# Altium project UltraZohm_ADC.PrjPCB (part 1 of 2)
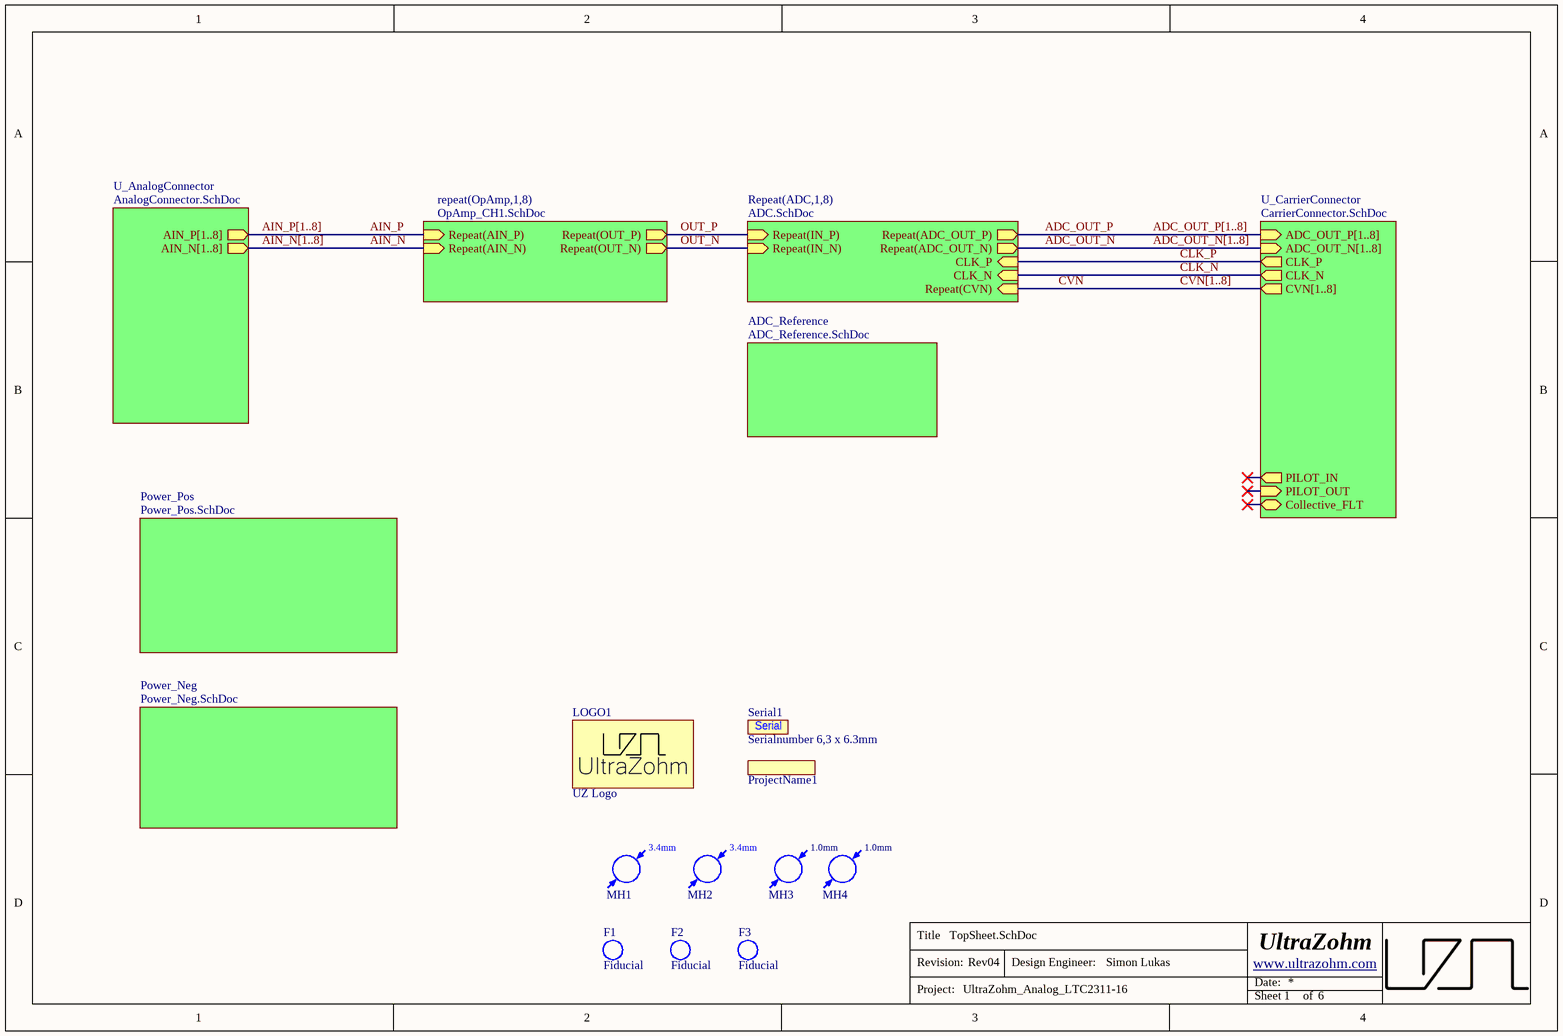
[diagram p0: TopSheet.SchDoc]
ProjectRevision: Rev04; ProjectName: UltraZohm_Analog_LTC2311-16; ProjectAuthor: Simon Lukas; Date: 09/20; AuthorParam: Simon Lukas; Author: S.Lukas
7 sheets, 508 parts. Net scope: hierarchical (ports join the sheet entries above them; power ports are global).
Board file: UltraZohm_ADC.PcbDoc
Sheets:
  TopSheet.SchDoc
    U_CarrierConnector = CarrierConnector.SchDoc
    U_AnalogConnector = AnalogConnector.SchDoc
    ADC1 = ADC.SchDoc
    ADC2 = ADC.SchDoc
    ADC3 = ADC.SchDoc
    ADC4 = ADC.SchDoc
    ADC5 = ADC.SchDoc
    ADC6 = ADC.SchDoc
    ADC7 = ADC.SchDoc
    ADC8 = ADC.SchDoc
    OpAmp1 = OpAmp_CH1.SchDoc
    OpAmp2 = OpAmp_CH1.SchDoc
    OpAmp3 = OpAmp_CH1.SchDoc
    OpAmp4 = OpAmp_CH1.SchDoc
    OpAmp5 = OpAmp_CH1.SchDoc
    OpAmp6 = OpAmp_CH1.SchDoc
    OpAmp7 = OpAmp_CH1.SchDoc
    OpAmp8 = OpAmp_CH1.SchDoc
    Power_Neg = Power_Neg.SchDoc
  Power.SchDoc

## Sheet TopSheet.SchDoc
size A4; Author: Simon Lukas; CompanyName: Technische Hochschule Nürnberg Georg Simon Ohm; Organization: UltraZohm; Address1: Kesslerplatz 12; Address2: 90489 Nürnberg; Address3: GERMANY; DocumentNumber: 1; SheetNumber: 1; SheetTotal: 6; Website: www.ultrazohm.com

### Parts
F1  Fiducial  [Fiducial_1.7mm]  (no BOM)
F2  Fiducial  [Fiducial_1.7mm]  (no BOM)
F3  Fiducial  [Fiducial_1.7mm]  (no BOM)
LOGO1  UZ Logo  [UZ_Logo_tiny]  (no BOM)
MH1  mounting hole 3,4mm  [MH_3.4]  (value not drawn)  (no BOM)
MH2  mounting hole 3,4mm  [MH_3.4]  (value not drawn)  (no BOM)
MH3  alignment hole 1mm  [MH_1]  (value not drawn)
MH4  alignment hole 1mm  [MH_1]  (value not drawn)
ProjectName1  Project Name, Rev  [ID_ProjectRev]  (value not drawn)  (no BOM)
Serial1  Serialnumber 6,3 x 6.3mm  [Serial_6.3x6.3mm]  (no BOM)

### Sub-sheets
ADC_Reference = ADC_Reference.SchDoc (file not in this document): no entries
Power_Neg = Power_Neg.SchDoc: no entries
Power_Pos = Power_Pos.SchDoc (file not in this document): no entries
Repeat(ADC,1,8) = ADC.SchDoc: Repeat(CVN) (in), Repeat(ADC_OUT_N) (out), Repeat(ADC_OUT_P) (out), Repeat(IN_N) (in), CLK_P (in), CLK_N (in), Repeat(IN_P) (in)
repeat(OpAmp,1,8) = OpAmp_CH1.SchDoc: Repeat(AIN_P) (in), Repeat(AIN_N) (in), Repeat(OUT_P) (out), Repeat(OUT_N) (out)
U_AnalogConnector = AnalogConnector.SchDoc: AIN_P[1..8] (out), AIN_N[1..8] (out)
U_CarrierConnector = CarrierConnector.SchDoc: PILOT_OUT (in), PILOT_IN (out), Collective_FLT (bidir), CLK_P (out), CLK_N (out), ADC_OUT_P[1..8] (in), ADC_OUT_N[1..8] (in), CVN[1..8] (out)

### Nets
ADC_OUT_N: sheet Repeat(ADC,1,8)/Repeat(ADC_OUT_N)
ADC_OUT_P: sheet Repeat(ADC,1,8)/Repeat(ADC_OUT_P)
AIN_N: sheet repeat(OpAmp,1,8)/Repeat(AIN_N)
AIN_P: sheet repeat(OpAmp,1,8)/Repeat(AIN_P)
CLK_N: sheet U_CarrierConnector/CLK_N, sheet Repeat(ADC,1,8)/CLK_N
CLK_P: sheet U_CarrierConnector/CLK_P, sheet Repeat(ADC,1,8)/CLK_P
CVN: sheet Repeat(ADC,1,8)/Repeat(CVN)
OUT_N: sheet Repeat(ADC,1,8)/Repeat(IN_N), sheet repeat(OpAmp,1,8)/Repeat(OUT_N)
OUT_P: sheet Repeat(ADC,1,8)/Repeat(IN_P), sheet repeat(OpAmp,1,8)/Repeat(OUT_P)

### Buses and harness runs
bus ADC_OUT_N[1..8] = sheet U_CarrierConnector/ADC_OUT_N[1..8]
bus ADC_OUT_P[1..8] = sheet U_CarrierConnector/ADC_OUT_P[1..8]
bus AIN_N[1..8] = sheet U_AnalogConnector/AIN_N[1..8]
bus AIN_P[1..8] = sheet U_AnalogConnector/AIN_P[1..8]
bus CVN[1..8] = sheet U_CarrierConnector/CVN[1..8]

### Notes on the sheet
- Title
- Revision:
- Design Engineer:
- Date:
- Project:
- Sheet
- of
- (in symbol Mounting Hole) 3.4mm
- (in symbol Mounting Hole - 1mm) 1.0mm
- (in symbol SerialNumber) Serial

### Library data of the parts
F1-F3 = Fiducial: Fiducial for Assembler
LOGO1 = UZ Logo: UltraZohm Logo on PCB; Created: Jan2021_Liegmann; Value: UZ Logo
MH1 MH2 = Mounting Hole: Non plated through hole, 3.4mm
MH3 MH4 = Mounting Hole - 1mm: Non plated through hole, 1mm
ProjectName1 = ID_ProjectRev: Project Name and Revision Number; Created: 2018_11_23_AGeiger; Value: Project Name, Rev
Serial1 = SerialNumber: Created: 2018_09_18_AGeiger; Value: Serialnumber 6,3 x 6.3mm

## Sheet CarrierConnector.SchDoc
size A4; Author: Simon Lukas; CompanyName: Technische Hochschule Nürnberg Georg Simon Ohm; Organization: UltraZohm; Address1: Kesslerplatz 12; Address2: 90489 Nürnberg; Address3: GERMANY; DocumentNumber: 3; SheetNumber: 3; SheetTotal: 6; Website: www.ultrazohm.com
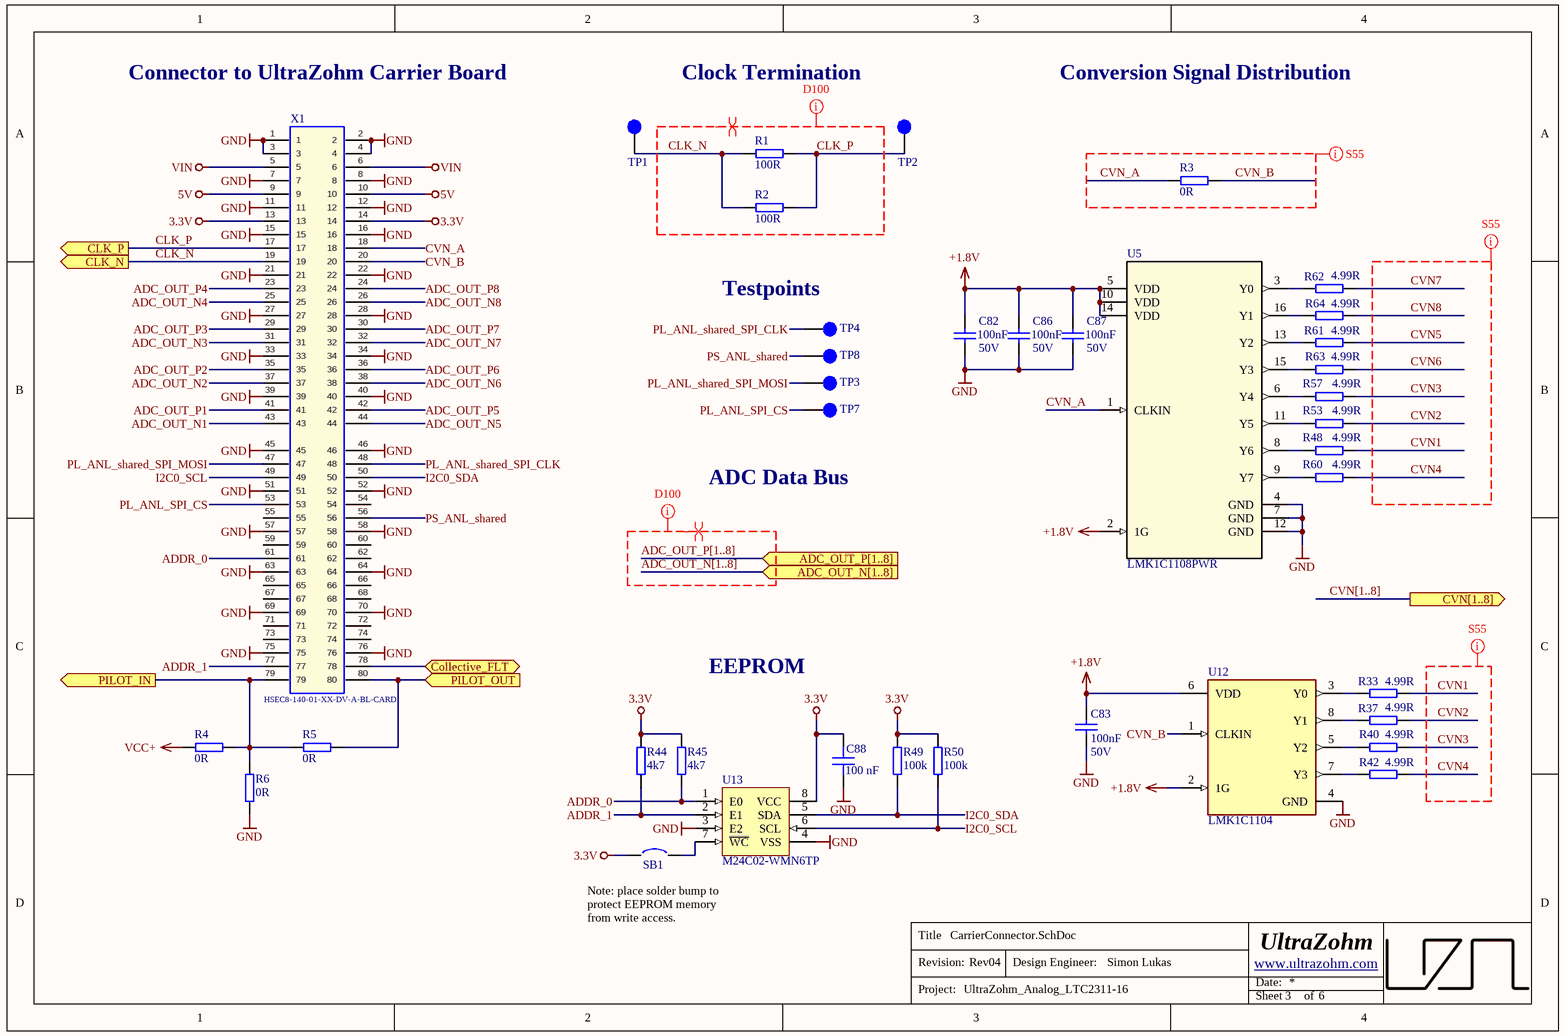
[diagram p1: CarrierConnector.SchDoc]

### Parts
C82  100nF  Voltage: 50V  [CAPC1608X07N]
C83  100nF  Voltage: 50V  [CAPC1608X07N]
C86  100nF  Voltage: 50V  [CAPC1608X07N]
C87  100nF  Voltage: 50V  [CAPC1608X07N]
C88  100 nF  [C_0603]
R1  100R  [RESC1608X06N]
R2  100R  [RESC1608X06N]
R3  0R  [RESC1608X06N]
R4  0R  [RESC1608X06N]
R5  0R  [RESC1608X06N]
R6  0R  [RESC1608X06N]
R33  4.99R  [RESC1608X06N]
R37  4.99R  [RESC1608X06N]
R40  4.99R  [RESC1608X06N]
R42  4.99R  [RESC1608X06N]
R44  4k7  [RES 0603_1608]
R45  4k7  [RES 0603_1608]
R48  4.99R  [RESC1608X06N]
R49  100k  [RES 0603_1608]
R50  100k  [RES 0603_1608]
R53  4.99R  [RESC1608X06N]
R57  4.99R  [RESC1608X06N]
R60  4.99R  [RESC1608X06N]
R61  4.99R  [RESC1608X06N]
R62  4.99R  [RESC1608X06N]
R63  4.99R  [RESC1608X06N]
R64  4.99R  [RESC1608X06N]
SB1  Solder Bump 0603  [SB_0603]  (value not drawn)  (no BOM)
TP1  ACLK_N  [TP_1mm]  (value not drawn)  (no BOM)
TP2  ACLK_P  [TP_1mm]  (value not drawn)  (no BOM)
TP3  PIN47  [TP_1mm]  (value not drawn)  (no BOM)
TP4  PIN48  [TP_1mm]  (value not drawn)  (no BOM)
TP7  PIN53  [TP_1mm]  (value not drawn)  (no BOM)
TP8  PIN56  [TP_1mm]  (value not drawn)  (no BOM)
U5  LMK1C1108PWR  [PW0016A_M]
U12  LMK1C1104  [FP-PW0008A-MFG]
U13  M24C02-WMN6TP  [D0008A_N]
X1  HSEC8-140-01-XX-DV-A-BL-CARD  [HSEC8-140-01-XX-DV-A-BL-CARD]  (no BOM)

### Ports
ADC_OUT_N[1..8] (in), ADC_OUT_P[1..8] (in), CLK_N (out), CLK_P (out), Collective_FLT (bidir), CVN[1..8] (out), PILOT_IN (out), PILOT_OUT (in)

### Nets
3.3V: C88.1 R44.2 R45.2 R49.2 R50.2 SB1.1 U13.8(VCC) X1.13 X1.14
5V: X1.9 X1.10
+1.8V: C82.1 C83.1 C86.1 C87.1 U5.2(1G) U5.5(VDD) U5.10(VDD) U5.14(VDD) U12.2(1G) U12.6(VDD)
GND: C82.2 C83.2 C86.2 C87.2 C88.2 R6.1 U5.4(GND) U5.7(GND) U5.12(GND) U12.4(GND) U13.3(E2) U13.4(VSS) X1.1 X1.2 X1.3 X1.4 X1.7 X1.8 X1.11 X1.12 X1.15 X1.16 X1.21 X1.22 X1.27 X1.28 X1.33 X1.34 X1.39 X1.40 X1.45 X1.46 X1.51 X1.52 X1.57 X1.58 X1.63 X1.64 X1.69 X1.70 X1.75 X1.76
VCC+: R4.1
VIN: X1.5 X1.6
ADC_OUT_N1: X1.43
ADC_OUT_N2: X1.37
ADC_OUT_N3: X1.31
ADC_OUT_N4: X1.25
ADC_OUT_N5: X1.44
ADC_OUT_N6: X1.38
ADC_OUT_N7: X1.32
ADC_OUT_N8: X1.26
ADC_OUT_P1: X1.41
ADC_OUT_P2: X1.35
ADC_OUT_P3: X1.29
ADC_OUT_P4: X1.23
ADC_OUT_P5: X1.42
ADC_OUT_P6: X1.36
ADC_OUT_P7: X1.30
ADC_OUT_P8: X1.24
ADDR_0: R45.1 U13.1(E0) X1.61
ADDR_1: R44.1 U13.2(E1) X1.77
CLK_N: R1.1 R2.1 TP1.1 X1.19 ; port CLK_N
CLK_P: R1.2 R2.2 TP2.1 X1.17 ; port CLK_P
CVN1: R33.2 R48.2
CVN2: R37.2 R53.2
CVN3: R40.2 R57.2
CVN4: R42.2 R60.2
CVN5: R61.2
CVN6: R63.2
CVN7: R62.2
CVN8: R64.2
CVN_A: R3.1 U5.1(CLKIN) X1.18
CVN_B: R3.2 U12.1(CLKIN) X1.20
I2C0_SCL: R50.1 U13.6(SCL) X1.49
I2C0_SDA: R49.1 U13.5(SDA) X1.50
PL_ANL_shared_SPI_CLK: TP4.1 X1.48
PL_ANL_shared_SPI_MOSI: TP3.1 X1.47
PL_ANL_SPI_CS: TP7.1 X1.53
PS_ANL_shared: TP8.1 X1.56
NetR4_2: R4.2 R5.1 R6.2 X1.79 ; port PILOT_IN
NetR5_2: R5.2 X1.80 ; port PILOT_OUT
NetR33_1: R33.1 U12.3(Y0)
NetR37_1: R37.1 U12.8(Y1)
NetR40_1: R40.1 U12.5(Y2)
NetR42_1: R42.1 U12.7(Y3)
NetR48_1: R48.1 U5.8(Y6)
NetR53_1: R53.1 U5.11(Y5)
NetR57_1: R57.1 U5.6(Y4)
NetR60_1: R60.1 U5.9(Y7)
NetR61_1: R61.1 U5.13(Y2)
NetR62_1: R62.1 U5.3(Y0)
NetR63_1: R63.1 U5.15(Y3)
NetR64_1: R64.1 U5.16(Y1)
NetSB1_2: SB1.2 U13.7(~{WC})
NetX1_78: X1.78 ; port Collective_FLT

Not connected (* = marked no-connect by the designer): X1 54 55 59 60 62 65 66 67 68 71 72 73 74

### Buses and harness runs
bus ADC_OUT_N[1..8] = port ADC_OUT_N[1..8]
bus ADC_OUT_P[1..8] = port ADC_OUT_P[1..8]
bus CVN[1..8] = port CVN[1..8]

### Layout directives
differential pair: ADC_OUT_N[1..8], ADC_OUT_P[1..8], CLK_N, CLK_P
net class D100: ADC_OUT_N[1..8], ADC_OUT_P[1..8], CLK_N, CLK_P
net class S55: CVN1, CVN2, CVN3, CVN4, CVN5, CVN6, CVN7, CVN8, CVN_A, CVN_B

### Notes on the sheet
- Connector to UltraZohm Carrier Board
- Clock Termination
- Conversion Signal Distribution
- (near TP4) Testpoints
- ADC Data Bus
- EEPROM
- Note: place solder bump to protect EEPROM memory from write access.
- Title
- Revision:
- Design Engineer:
- Date:
- Project:
- Sheet
- of

### Library data of the parts
C82 C83 C86 C87 = Cap_0603: MPN: CC0603KRX7R9BB104; MF: Yageo; Dielectric: X5R; Value: 100nF; Supplier 1: Mouser; Supplier 2: Mouser; Supplier Part Number 1: 603-CC603KRX7R9BB104; Supplier Part Number 2: 710-885382206004; Package: 0603
C88 = C0603C104K9PACTU: Capacitor 0603, 6.3 VDC, 100 nF, X5R; Manufacturer: KEMET; Tolerance: 10 %; Voltage Rating: 6.3 VDC; Created from: MGremer; Manufacturer Part Number: C0603C104K9PACTU; PartID: 70; Created On: 20.12.2020 13:54:13; ComponentLink1Description: Datasheet; ComponentLink1URL: https://www.mouser.de/datasheet/2/212/KEM_C1006_X5R_SMD-1103249.pdf; Component Type: Capacitor 0603; Device Package: 0603; Last Updated: 20.01.2021 13:57:36; Mounting Type: SMD; Operating Temperature: -55 - 85°C; Series: SMD Comm X5R; Supplier 1: Mouser; Supplier Part Number 1: 80-C0603C104K9P; Type: Capacitor; Value: 100 nF; Live Cycle Status: 1; Stock number: not stored; MF: KEMET; MPN: C0603C104K9PACTU; Package: 0603
R1 R2 = R_0603: MPN: AC0603FR-13100RL; MF: Yageo; Tolerance: 1%; Value: 100R; Supplier 1: Mouser; Supplier Part Number 1: 603-AC0603FR-13100RL; Package: 0603
R3-R6 = R_0603: MPN: CRCW06030000Z0EBC; MF: Vishay / Dale; Value: 0R; Supplier 1: Mouser; Supplier Part Number 1: 71-CRCW06030000Z0EBC; Package: 0603
R33 R37 R40 R42 R48 R53 R57 R60-R64 = R_0603: MPN: CRCW06034R99FKEA; MF: Vishay / Dale; Tolerance: 1%; Value: 4.99R; Supplier 1: Mouser; Supplier Part Number 1: 71-CRCW0603-4.99-E3; Package: *
R44 R45 = 0603WAF4701T5E: SMD resistor E24 series; Manufacturer: UNI-ROYAL; Tolerance: 1%; Created from: AGeiger; Manufacturer Part Number: 0603WAF4701T5E; PartID: 90; Created On: 14.12.2020 16:17:14; ComponentLink1Description: Datasheet; ComponentLink1URL: https://datasheet.lcsc.com/lcsc/2206010116_UNI-ROYAL-Uniroyal-Elec-0603WAF4701T5E_C23162.pdf; Component Type: SMD resistor; Device Package: 0603; Last Updated: 25.08.2022 20:03:04; Mounting Type: SMD; Supplier 1: LCSC; Supplier Part Number 1: C23162; Type: Resistor; Value: 4k7; Live Cycle Status: 1; Stock number: Labor SMD Container; LCSC Part Number: C23162; Package: 0603
R49 R50 = RK73B1JTTD104J: SMD resistor E24 series; Manufacturer: KOA Speer; Tolerance: 5%; Created from: MGremer; Manufacturer Part Number: RK73B1JTTD104J; PartID: 122; Created On: 14.12.2020 16:17:14; ComponentLink1Description: Datasheet; ComponentLink1URL: https://www.mouser.de/datasheet/2/219/RK73B-1825463.pdf; Component Type: SMD resistor; Device Package: 0603; Last Updated: 27.05.2022 14:04:10; Mounting Type: SMD; Supplier 1: Mouser; Supplier Part Number 1: 660-RK73B1JTTD104J; Type: Resistor; Value: 100k; Live Cycle Status: 1; Stock number: Labor SMD Container; LCSC Part Number: C25803
SB1 = =Value: Created from: AGeiger; Revision: July-2002: Re-released for DXP Platform.; PartID: 1; Created On: 09.01.2024 17:13:56; Component Type: Solder Bump; Device Package: 0603; Last Updated: 09.01.2024 17:13:56; Manufacturer Part Number: Solder Bump 0603; Mounting Type: SMD; Value: Solder Bump 0603
TP1-TP4 TP7 TP8 = TP_1mm: Testpoint 1mm; Created: 2018_06_25_AGeiger; Value: Testpoint 1mm
U5 = LMK1C1108PWR: 8-channel output LVCMOS 1.8V buffer; MF: Texas Instruments; MPN: LMK1C1108PWR; Supplier 1: Digi-Key; Supplier 2: Mouser; Supplier Part Number 1: 296-LMK1C1108PWRCT-ND; Supplier Part Number 2: 595-LMK1C1108PWR
U12 = LMK1C1104: 4-channel output LVCMOS 1.8-V buffer; Manufacturer: Texas Instruments; Manufacturer Part Number: LMK1C1104PWR; Number of Outputs: 4; Frequency: 250MHz; Max Supply Voltage: 3.465V; Min Supply Voltage: 1.71V; Propagation Delay: 3ns; Mount: Surface Mount; Package: TSSOP; Number of Pins: 8; Input: LVCMOS; Supplier 1: Mouser; Supplier Part Number 1: 595-LMK1C1104PWR; ComponentLink1Description: Manufacturer; ComponentLink1URL: https://www.ti.com/; ComponentLink2Description: Datasheet; ComponentLink2URL: https://www.ti.com/lit/ds/symlink/lmk1c1104.pdf?ts=1616933763692&ref_url=https%253A%252F%252Fwww.ti.com%252Fproduct%252FLMK1C1104; Supplier 2: Mouser; Supplier Part Number 2: 972-5PB1104PGGK8; MF: Texas Instruments; MPN: LMK1C1104PWR
U13 = M24C02-WMN6TP: 2Kbit I2C SOP-8 EEPROM ROHS; Manufacturer: STMicroelectronics; Created from: AGeiger; Manufacturer Part Number: M24C02-WMN6TP; PartID: 1; Created On: 19.11.2023 14:54:27; ComponentLink1Description: Datasheet; ComponentLink1URL: https://www.st.com/resource/en/datasheet/m24c01-w.pdf; Component Type: EEPROM; Device Package: SOIC-8; Last Updated: 19.11.2023 21:39:04; Mounting Type: SMD; Operating Temperature: -40 to +85 °C; Series: M24xxx; Supplier 1: Mouser; Supplier Part Number 1: 511-M24C02-WMN6TP; Supplier 2: LCSC; Supplier Part Number 2: C7562; Type: Memory; Value: M24C02-WMN6TP; LCSC Part Number: C7562; MF: STMicroelectronics; MPN: M24C02-WMN6TP
X1 = HSEC8-140-01-XX-DV-A-BL-CARD: Mating Card Layout for HSEC8-140-01-XX-DV-A-BL; Manufacturer: SAMTEC; Created: 2018_04_23_AGeiger; Value: HSEC8-140-01-XX-DV-A-BL-CARD; ComponentLink1Description: Info; ComponentLink1URL: https://www.samtec.com/de/products/hsec8-140-01-l-dv-a-bl-k-tr; MF: SAMTEC

## Sheet AnalogConnector.SchDoc
size A4; Author: Simon Lukas; CompanyName: Technische Hochschule Nürnberg Georg Simon Ohm; Organization: UltraZohm; Address1: Kesslerplatz 12; Address2: 90489 Nürnberg; Address3: GERMANY; DocumentNumber: 4; SheetNumber: 4; SheetTotal: 6; Website: www.ultrazohm.com
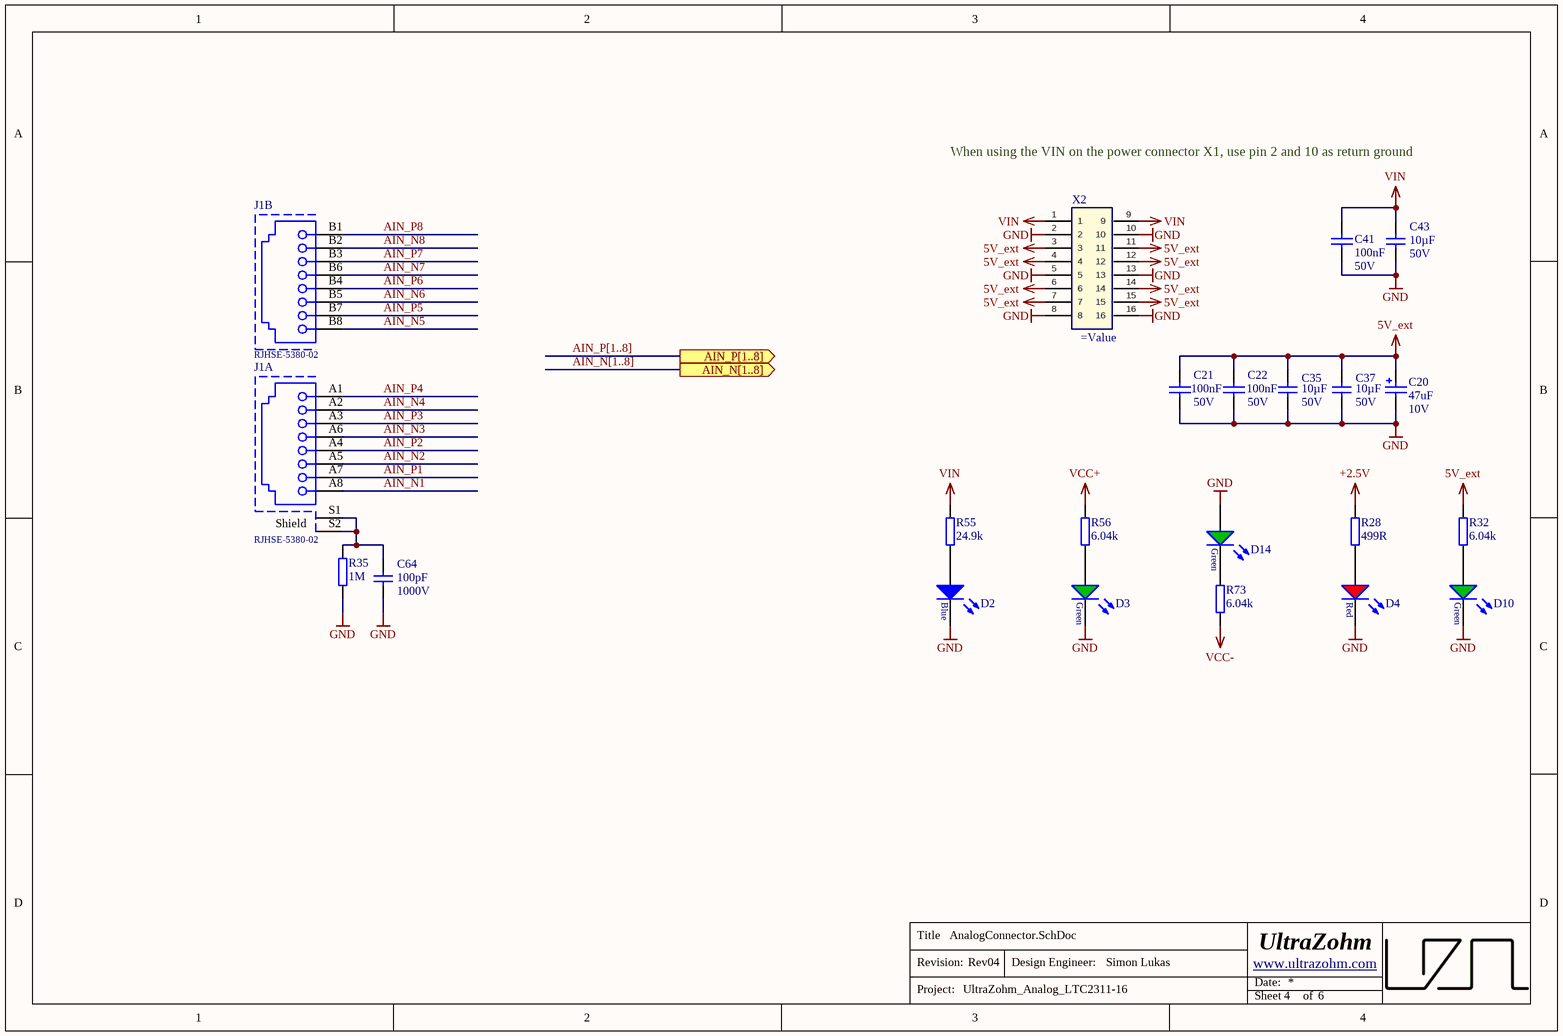
[diagram p2: AnalogConnector.SchDoc]

### Parts
C20  47uF  Voltage: 10V  [WCAP-ASLI_5x5.5]
C21  100nF  Voltage: 50V  [CAPC1608X07N]
C22  100nF  Voltage: 50V  [CAPC1608X07N]
C35  10µF  Voltage: 50V  [C_1206]
C37  10µF  Voltage: 50V  [C_1206]
C41  100nF  Voltage: 50V  [CAPC1608X07N]
C43  10µF  Voltage: 50V  [C_1206]
C64  100pF  Voltage: 1000V  [C_1206]
D2  150060BS75000  [WL-SMCW_0603]  (value not drawn)
D3  150060GS75000  [WL-SMCW_0603]  (value not drawn)
D4  150060RS75000  [WL-SMCW_0603]  (value not drawn)
D10  150060GS75000  [WL-SMCW_0603]  (value not drawn)
D14  150060GS75000  [WL-SMCW_0603]  (value not drawn)
J1  RJHSE-5380-02  [RJHSE-5380-02]  (parts A,B of 2)
R28  499R  [RESC1608X06N]
R32  6.04k  [RESC1608X06N]
R35  1M  [RESC1608X06N]
R55  24.9k  [RESC1608X06N]
R56  6.04k  [RESC1608X06N]
R73  6.04k  [RESC1608X06N]
X2  (no value)  [IPL1-108-01-L-D-RA-K]

### Ports
AIN_N[1..8] (out), AIN_P[1..8] (out)

### Nets
5V_ext: C20.2(P) C21.2 C22.2 C35.2 C37.2 R32.2 X2.3 X2.4 X2.6 X2.7 X2.11 X2.12 X2.14 X2.15
+2.5V: R28.2
GND: C20.1(N) C21.1 C22.1 C35.1 C37.1 C41.1 C43.1 C64.1 D2.1(K) D3.1(K) D4.1(K) D10.1(K) D14.2(A) R35.1 X2.2 X2.5 X2.8 X2.10 X2.13 X2.16
VCC+: R56.2
VCC-: R73.1
VIN: C41.2 C43.2 R55.2 X2.1 X2.9
AIN_N1: J1.A8
AIN_N2: J1.A5
AIN_N3: J1.A6
AIN_N4: J1.A2
AIN_N5: J1.B8
AIN_N6: J1.B5
AIN_N7: J1.B6
AIN_N8: J1.B2
AIN_P1: J1.A7
AIN_P2: J1.A4
AIN_P3: J1.A3
AIN_P4: J1.A1
AIN_P5: J1.B7
AIN_P6: J1.B4
AIN_P7: J1.B3
AIN_P8: J1.B1
NetC64_2: C64.2 J1.S1 J1.S2 R35.2
NetD2_2: D2.2(A) R55.1
NetD3_2: D3.2(A) R56.1
NetD4_2: D4.2(A) R28.1
NetD10_2: D10.2(A) R32.1
NetD14_1: D14.1(K) R73.2

### Buses and harness runs
bus AIN_N[1..8] = port AIN_N[1..8]
bus AIN_P[1..8] = port AIN_P[1..8]

### Notes on the sheet
- When using the VIN on the power connector X1, use pin 2 and 10 as return ground
- (near J1) Shield
- Title
- Revision:
- Design Engineer:
- Date:
- Project:
- Sheet
- of

### Library data of the parts
C20 = 865080142007: WCAP-ASLI Aluminum Electrolytic Capacitor, V-Chip, SMT, D5xH5.5mm, 47uF, 10V; MPN: 865080242004; Dissipation Factor: 24%; Endurance: 2000h; Leakage Current: 6.3uA; MF: Wurth Elektronik; Ripple Current: 170mA; Capacitance Tolerance: +/-20%; Technical Reference: ASEC055101M6R3DVCTBB000; ComponentLink1Description: Manufacturer; ComponentLink1URL: http://www.we-online.de; ComponentLink2Description: Datasheet; ComponentLink2URL: https://www.we-online.com/catalog/datasheet/865080142007.pdf; Height: 5.5mm; Mounting Technology: SMT; Operating Temperature: -55 to +105degC; Packaging: Tape and Reel; Published Date: May 2020; Diameter: 5mm; Supplier 1: Mouser; Supplier Part Number 1: 710-865080242004; Value: 47uF
C21 C22 = Cap_0603: as C82 on sheet CarrierConnector; Value: 100nF; Supplier 1: Mouser; Supplier 2: Mouser; Supplier Part Number 1: 603-CC603KRX7R9BB104; Supplier Part Number 2: 710-885382206004; Package: 0603
C35 C37 = C_1206: Capacitor 1206; MPN: CL31A106MBHNNNE; Tolerance: 10%; MF: Samsung; Dielectric: X5R; Package: 1206; Value: 10µF; Created: 2020_09_17_Liegmann; Supplier 1: Mouser; Supplier Part Number 1: 187-CL31A106MBHNNNE
C41 = Cap_0603: MPN: CC0603KRX7R9BB104; MF: Yageo; Tolerance: 10%; Dielectric: X5R; Value: 100nF; Supplier 1: Mouser; Supplier 2: Mouser; Supplier Part Number 1: 603-CC603KRX7R9BB104; Supplier Part Number 2: 710-885382206004; Package: 0603
C43 = C_1206: Capacitor 1206; MPN: CL31A106MBHNNNE; Tolerance: 20%; MF: Samsung; Dielectric: X5R; Package: 1206; Value: 10µF; Supplier 1: Mouser; Supplier Part Number 1: 187-CL31A106MBHNNNE
C64 = C_1206: Capacitor 1206; MPN: 885342008009; Tolerance: 5%; MF: Würth Elektronik; Dielectric: C0G; Package: 1206; Value: 100pF; Created: 2018_06_25_AGeiger; Supplier 1: Mouser; Supplier Part Number 1: 710-885342008009
D2 = LED_Blue_0603: WL-SMCW SMD Mono-color Chip LED Waterclear, size 0603, Blue, 3.2 V, 140°; Forward Voltage: 3.2 V; Luminous Intensity: 145 mcd; Peak Wavelength: 465 nm; Dominant Wavelength: 470 nm; MF: Wuerth Elektronik; Published Date: Sep. 2017; ComponentLink1Description: Manufacturer; ComponentLink1URL: http://www.we-online.de; ComponentLink2Description: Datasheet; ComponentLink2URL: http://katalog.we-online.com/led/datasheet/150060BS75000.pdf; MPN: 150060BS75000; Size: 0603; Viewing Angle: 140°; Emitting Color: Blue; Value: 150060BS75000; Package: 0603; Created: 2018_09_06_AGeiger; Supplier 1: Farnell; Supplier Part Number 1: 2322069; Supplier 2: Mouser; Supplier Part Number 2: 710-150060BS75000; Supplier 3: Digi-Key; Supplier Part Number 3: 732-4966-1-ND
D3 D10 D14 = LED_Green_0603: WL-SMCW SMD Mono-color Chip LED Waterclear, size 0603, Green, 3.2 V, 140°; Forward Voltage: 3.2 V; Luminous Intensity: 430 mcd; Peak Wavelength: 515 nm; Dominant Wavelength: 520 nm; MF: Wuerth Elektronik; Published Date: Sep. 2017; ComponentLink1Description: Manufacturer; ComponentLink1URL: http://www.we-online.de; ComponentLink2Description: Datasheet; ComponentLink2URL: http://katalog.we-online.com/led/datasheet/150060GS75000.pdf; MPN: 150060GS75000; Size: 0603; Viewing Angle: 140°; Emitting Color: Green; Value: 150060GS75000; Package: 0603; Created: 2018_09_06_AGeiger; Supplier 1: Farnell; Supplier Part Number 1: 2322070; Supplier 2: Mouser; Supplier Part Number 2: 710-150060GS75000; Supplier 3: Digi-Key; Supplier Part Number 3: 732-4971-1-ND
D4 = LED_Red_0603: WL-SMCW SMD Mono-color Chip LED Waterclear, size 0603, Red, 2 V, 140°; Forward Voltage: 2 V; Luminous Intensity: 250 mcd; Peak Wavelength: 630 nm; Dominant Wavelength: 625 nm; MF: Wuerth Elektronik; Published Date: Sep. 2017; ComponentLink1Description: Manufacturer; ComponentLink1URL: http://www.we-online.de; ComponentLink2Description: Datasheet; ComponentLink2URL: http://katalog.we-online.com/led/datasheet/150060RS75000.pdf; MPN: 150060RS75000; Size: 0603; Viewing Angle: 140°; Emitting Color: Red; Value: 150060RS75000; Package: 0603; Created: 2018_09_06_AGeiger; Supplier 1: Farnell; Supplier Part Number 1: 2322071; Supplier 2: Mouser; Supplier Part Number 2: 710-150060RS75000; Supplier 3: Digi-Key; Supplier Part Number 3: 732-4978-1-ND
J1 = RJHSE-5380-02: Modular Connectors / Ethernet Connectors CAT 5 MODULAR JACK HIGH TEMP; MF: Amphenol; Pin Number: 8P8C; Port: 1x2; Entrance: Right Angle; Compliance: Lead free / RoHS; Rated Current: 1.5 A; Working Voltage: 125 VAC; Withstanding Voltage: 1000 VAC; Contact Resistance: 20 mOhm; ComponentLink1Description: Manufacturer; ComponentLink1URL: https://www.amphenol-icc.com/; ComponentLink2Description: Datasheet; ComponentLink2URL: https://cdn.amphenol-icc.com/media/wysiwyg/files/documentation/datasheet/inputoutput/io-modjack-rjhse.pdf; MPN: RJHSE-5380-02; Published Date: July 2018; Operating Temperature: -55 to 85 degC; Mounting Technology: THT; Packaging: Tray; Supplier 1: Mouser; Supplier Part Number 1: 523-RJHSE-5380-02; ComponentLink3Description: Product Drawing; ComponentLink3URL: https://cdn.amphenol-icc.com/media/wysiwyg/files/drawing/rjhsex38002.pdf
R28 = R_0603: MPN: CRCW0603499RFKEAC; MF: Vishay / Dale; Value: 499R; Supplier 1: Mouser; Supplier Part Number 1: 71-CRCW0603499RFKEAC; Package: 0603
R32 R56 R73 = R_0603: MPN: RCS06036K04FKEA; MF: Vishay / Dale; Value: 6.04k; Supplier 1: Mouser; Supplier Part Number 1: 71-RCS06036K04FKEA; Package: 0603
R35 = R_0603: MPN: CRCW06031M00FKEAC; MF: Vishay / Dale; Tolerance: 1%; Value: 1M; Supplier 1: mouser; Supplier Part Number 1: 71-CRCW06031M00FKEAC; Package: 0603
R55 = R_0603: MPN: CRCW060324K9FKEAC; MF: Vishay / Dale; Value: 24.9k; Supplier 1: Mouser; Supplier Part Number 1: 71-CRCW060324K9FKEAC; Package: 0603
X2 = IPL1-108-XX-X-D-X: 2.54mm Double Row Terminal Assembly; MF: SAMTEC; Value: IPL1-108-01-L-D-RA-K; Created: 2018_09_17_AGeiger; MPN: IPL1-108-01-L-D-RA-K; Supplier 1: Mouser; Supplier Part Number 1: 200-IPL110801LDRAK

## Sheet ADC.SchDoc
size A4; Author: Simon Lukas; CompanyName: Technische Hochschule Nürnberg Georg Simon Ohm; Organization: UltraZohm; Address1: Kesslerplatz 12; Address2: 90489 Nürnberg; Address3: GERMANY; DocumentNumber: 6; SheetNumber: 6; SheetTotal: 6; Website: www.ultrazohm.com
Used 8 times, as channels ADC1, ADC2, ADC3, ADC4, ADC5, ADC6, ADC7, ADC8. Parts and nets are listed once, with the designators drawn on the sheet.
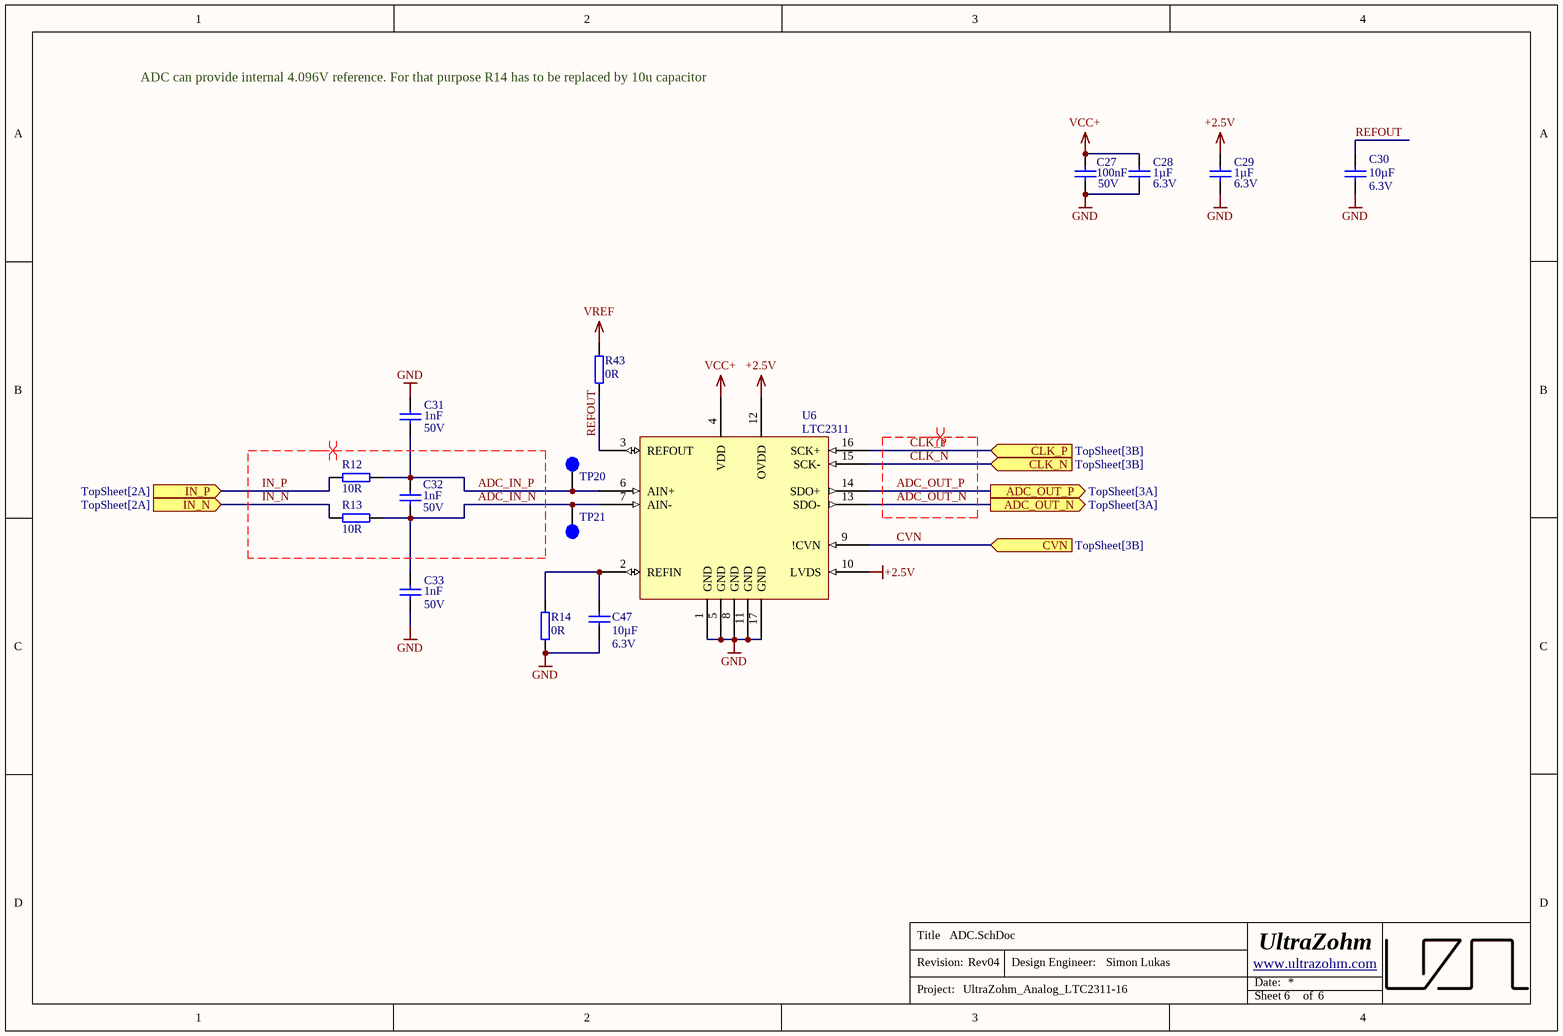
[diagram p3: ADC.SchDoc]

### Parts
C27  100nF  Voltage: 50V  [CAPC1608X07N]
C28  1µF  Voltage: 6.3V  [CAPC1608X07N]
C29  1µF  Voltage: 6.3V  [CAPC1608X07N]
C30  10µF  Voltage: 6.3V  [Cap0805]
C31  1nF  Voltage: 50V  [CAPC1608X07N]
C32  1nF  Voltage: 50V  [CAPC1608X07N]
C33  1nF  Voltage: 50V  [CAPC1608X07N]
C47  10µF  Voltage: 6.3V  [Cap0805]
R12  10R  [RESC1608X06N]
R13  10R  [RESC1608X06N]
R14  0R  [RESC1608X06N]
R43  0R  [RESC1608X06N]
TP20  +  [TP_1mm]  (value not drawn)  (no BOM)
TP21  -  [TP_1mm]  (value not drawn)  (no BOM)
U6  LTC2311  [TSSOP50P510X110_HS-17N]

### Ports
ADC_OUT_N (out, see TopSheet[3A]), ADC_OUT_P (out, see TopSheet[3A]), CLK_N (in, see TopSheet[3B]), CLK_P (in, see TopSheet[3B]), CVN (in, see TopSheet[3B]), IN_N (in, see TopSheet[2A]), IN_P (in, see TopSheet[2A])

### Nets
+2.5V: C29.1 U6.10(LVDS) U6.12(OVDD)
GND: C27.2 C28.2 C29.2 C30.2 C31.1 C33.2 C47.2 R14.1 U6.1(GND) U6.5(GND) U6.8(GND) U6.11(GND) U6.17(GND)
VCC+: C27.1 C28.1 U6.4(VDD)
VREF: R43.2
ADC_IN_N: C32.2 C33.1 R13.2 TP21.1 U6.7(AIN-)
ADC_IN_P: C31.2 C32.1 R12.2 TP20.1 U6.6(AIN+)
ADC_OUT_N: U6.13(SDO-) ; port ADC_OUT_N
ADC_OUT_P: U6.14(SDO+) ; port ADC_OUT_P
CLK_N: U6.15(SCK-) ; port CLK_N
CLK_P: U6.16(SCK+) ; port CLK_P
CVN: U6.9(!CVN) ; port CVN
IN_N: R13.1 ; port IN_N
IN_P: R12.1 ; port IN_P
REFOUT: C30.1 R43.1 U6.3(REFOUT)
NetC47_1: C47.1 R14.2 U6.2(REFIN)

### Channels
ADC1: designators end in A; ports ADC_OUT_N=ADC_OUT_N1 ADC_OUT_P=ADC_OUT_P1 CLK_N=CLK_N CLK_P=CLK_P CVN=CVN1 IN_N=OUT_N1 IN_P=OUT_P1
ADC2: designators end in B; ports ADC_OUT_N=ADC_OUT_N2 ADC_OUT_P=ADC_OUT_P2 CLK_N=CLK_N CLK_P=CLK_P CVN=CVN2 IN_N=OUT_N2 IN_P=OUT_P2
ADC3: designators end in C; ports ADC_OUT_N=ADC_OUT_N3 ADC_OUT_P=ADC_OUT_P3 CLK_N=CLK_N CLK_P=CLK_P CVN=CVN3 IN_N=OUT_N3 IN_P=OUT_P3
ADC4: designators end in D; ports ADC_OUT_N=ADC_OUT_N4 ADC_OUT_P=ADC_OUT_P4 CLK_N=CLK_N CLK_P=CLK_P CVN=CVN4 IN_N=OUT_N4 IN_P=OUT_P4
ADC5: designators end in E; ports ADC_OUT_N=ADC_OUT_N5 ADC_OUT_P=ADC_OUT_P5 CLK_N=CLK_N CLK_P=CLK_P CVN=CVN5 IN_N=OUT_N5 IN_P=OUT_P5
ADC6: designators end in F; ports ADC_OUT_N=ADC_OUT_N6 ADC_OUT_P=ADC_OUT_P6 CLK_N=CLK_N CLK_P=CLK_P CVN=CVN6 IN_N=OUT_N6 IN_P=OUT_P6
ADC7: designators end in G; ports ADC_OUT_N=ADC_OUT_N7 ADC_OUT_P=ADC_OUT_P7 CLK_N=CLK_N CLK_P=CLK_P CVN=CVN7 IN_N=OUT_N7 IN_P=OUT_P7
ADC8: designators end in H; ports ADC_OUT_N=ADC_OUT_N8 ADC_OUT_P=ADC_OUT_P8 CLK_N=CLK_N CLK_P=CLK_P CVN=CVN8 IN_N=OUT_N8 IN_P=OUT_P8

### Layout directives
differential pair: ADC_IN_N, ADC_IN_P, ADC_OUT_N, ADC_OUT_P, CLK_N, CLK_P, IN_N, IN_P

### Notes on the sheet
- ADC can provide internal 4.096V reference. For that purpose R14 has to be replaced by 10u capacitor
- Title
- Revision:
- Design Engineer:
- Date:
- Project:
- Sheet
- of

### Library data of the parts
C27 = Cap_0603: as C82 on sheet CarrierConnector; Value: 100nF; Supplier 1: Mouser; Supplier 2: Mouser; Supplier Part Number 1: 603-CC603KRX7R9BB104; Supplier Part Number 2: 710-885382206004; Package: 0603
C28 C29 = Cap_0603: MPN: JMK107BJ105MA-T; MF: Taiyo Yuden; Dielectric: X5R; Value: 1µF; Supplier 1: Mouser; Supplier Part Number 1: 963-JMK107BJ105MA-T; Package: 0603
C30 C47 = Cap0805: CAP CER 0805; MPN: CL21A106KQFNNNE; MF: Samsung Electro-Mechanics; Dielectric: X5R; Supplier 1: Mouser; Supplier 2: *; Supplier Part Number 1: 187-CL21A106KQFNNNE; Supplier Part Number 2: *; Package: 0805; Value: 10µF
C31-C33 = Cap_0603: MPN: GRM1885C1H102GA1D; MF: Murata; Dielectric: NP0; Value: 1nF; Supplier 1: Mouser; Supplier 2: Mouser; Supplier Part Number 1: 81-GRM1885C1H102GA1D; Supplier Part Number 2: 81-GRM1885C1H102GA1J; Package: 0603
R12 R13 = R_0603: MPN: RC0603FR-0710RL; MF: Yageo; Value: 10R; Supplier 1: Mouser; Supplier Part Number 1: 603-RC0603FR-0710RL; Package: 0603
R14 R43 = R_0603: as R3 on sheet CarrierConnector; Value: 0R; Supplier 1: Mouser; Supplier Part Number 1: 71-CRCW06030000Z0EBC; Package: 0603
TP20 TP21 = TP_1mm: Testpoint 1mm; Created: 2018_06_25_AGeiger
  TP20: Value: +
  TP21: Value: -
U6 = LTC2311-16: 16 Bit SAR ADC, 5MSps; MPN: LTC2311CMSE-16#PBF; MF: Analog Devices; Package: MSOP-16; Supplier 1: Mouser; Supplier 2: Digi-Key; Supplier Part Number 1: 584-C2311CMSE-16PBF; Supplier Part Number 2: LTC2311CMSE-16#PBF-ND; ComponentLink1Description: Manufacturer; ComponentLink1URL: https://www.analog.com/en/index.html; ComponentLink2Description: Datasheet; ComponentLink2URL: https://www.analog.com/media/en/technical-documentation/data-sheets/231116fa.pdf

## Sheet OpAmp_CH1.SchDoc
size A4; Author: Simon Lukas; CompanyName: Technische Hochschule Nürnberg Georg Simon Ohm; Organization: UltraZohm; Address1: Kesslerplatz 12; Address2: 90489 Nürnberg; Address3: GERMANY; DocumentNumber: 5; SheetNumber: 5; SheetTotal: 6; Website: www.ultrazohm.com
Used 8 times, as channels OpAmp1, OpAmp2, OpAmp3, OpAmp4, OpAmp5, OpAmp6, OpAmp7, OpAmp8. Parts and nets are listed once, with the designators drawn on the sheet.
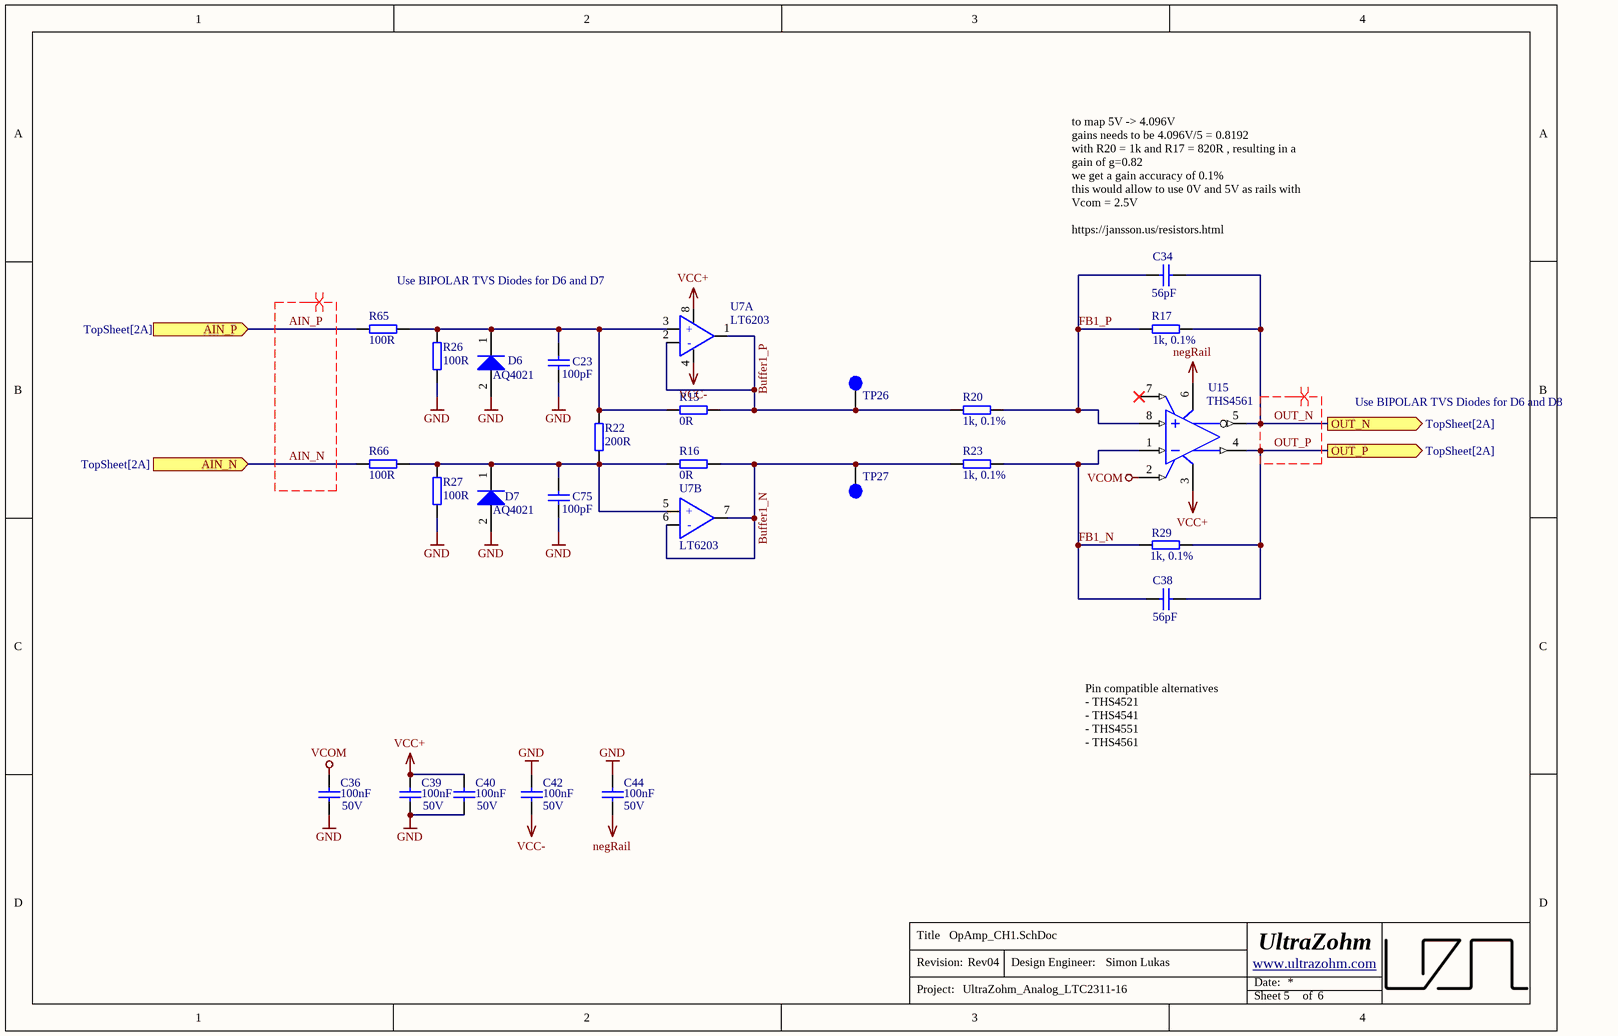
[diagram p4: OpAmp_CH1.SchDoc]

### Parts
C23  100pF  [CAPC1608X07N]
C34  56pF  [CAPC1608X07N]
C36  100nF  Voltage: 50V  [CAPC1608X07N]
C38  56pF  [CAPC1608X07N]
C39  100nF  Voltage: 50V  [CAPC1608X07N]
C40  100nF  Voltage: 50V  [CAPC1608X07N]
C42  100nF  Voltage: 50V  [CAPC1608X07N]
C44  100nF  Voltage: 50V  [CAPC1608X07N]
C75  100pF  [CAPC1608X07N]
D6  AQ4021  [SOD-323_SuppressorDiode]
D7  AQ4021  [SOD-323_SuppressorDiode]
R15  0R  [RESC1608X06N]
R16  0R  [RESC1608X06N]
R17  1k, 0.1%  [RESC1608X06N]
R20  1k, 0.1%  [RESC1608X06N]
R22  200R  [RESC3216X65N]
R23  1k, 0.1%  [RESC1608X06N]
R26  100R  [RESC1608X06N]
R27  100R  [RESC1608X06N]
R29  1k, 0.1%  [RESC1608X06N]
R65  100R  [RESC1608X06N]
R66  100R  [RESC1608X06N]
TP26  +  [TP_1mm]  (value not drawn)  (no BOM)
TP27  -  [TP_1mm]  (value not drawn)  (no BOM)
U7  LT6203  [MSOP8_3x3-8N]  (parts A,B of 2)
U15  THS4561  [DGK0008A_N]

### Ports
AIN_N (in, see TopSheet[2A]), AIN_P (in, see TopSheet[2A]), OUT_N (out, see TopSheet[2A]), OUT_P (out, see TopSheet[2A])

### Nets
GND: C23.2 C36.2 C39.2 C40.2 C42.1 C44.1 C75.2 D6.2(A) D7.2(A) R26.1 R27.1
negRail: C44.2 U15.6(VS-)
VCC+: C39.1 C40.1 U7.8 U15.3(VS+)
VCC-: C42.2 U7.4
VCOM: C36.1 U15.2(VOCM)
AIN_N: R66.1 ; port AIN_N
AIN_P: R65.1 ; port AIN_P
Buffer1_N: R16.2 R23.2 TP27.1 U7.6(-) U7.7
Buffer1_P: R15.2 R20.1 TP26.1 U7.1 U7.2(-)
FB1_N: C38.1 R23.1 R29.1 U15.1(VIN-)
FB1_P: C34.1 R17.1 R20.2 U15.8(VIN+)
OUT_N: C34.2 R17.2 U15.5(VOUT-) ; port OUT_N
OUT_P: C38.2 R29.2 U15.4(VOUT+) ; port OUT_P
NetC23_1: C23.1 D6.1(K) R15.1 R22.2 R26.2 R65.2 U7.3(+)
NetC75_1: C75.1 D7.1(K) R16.1 R22.1 R27.2 R66.2 U7.5(+)

Not connected (* = marked no-connect by the designer): U15 7(~{PD})*

### Channels
OpAmp1: designators end in A; ports AIN_N=AIN_N1 AIN_P=AIN_P1 OUT_N=OUT_N1 OUT_P=OUT_P1
OpAmp2: designators end in B; ports AIN_N=AIN_N2 AIN_P=AIN_P2 OUT_N=OUT_N2 OUT_P=OUT_P2
OpAmp3: designators end in C; ports AIN_N=AIN_N3 AIN_P=AIN_P3 OUT_N=OUT_N3 OUT_P=OUT_P3
OpAmp4: designators end in D; ports AIN_N=AIN_N4 AIN_P=AIN_P4 OUT_N=OUT_N4 OUT_P=OUT_P4
OpAmp5: designators end in E; ports AIN_N=AIN_N5 AIN_P=AIN_P5 OUT_N=OUT_N5 OUT_P=OUT_P5
OpAmp6: designators end in F; ports AIN_N=AIN_N6 AIN_P=AIN_P6 OUT_N=OUT_N6 OUT_P=OUT_P6
OpAmp7: designators end in G; ports AIN_N=AIN_N7 AIN_P=AIN_P7 OUT_N=OUT_N7 OUT_P=OUT_P7
OpAmp8: designators end in H; ports AIN_N=AIN_N8 AIN_P=AIN_P8 OUT_N=OUT_N8 OUT_P=OUT_P8

### Layout directives
differential pair: AIN_N, AIN_P, OUT_N, OUT_P

### Notes on the sheet
- (near C34) to map 5V -> 4.096V
  gains needs to be 4.096V/5 = 0.8192
  with R20 = 1k and R17 = 820R , resulting in a gain of g=0.82
  we get a gain accuracy of 0.1%
  this would allow to use 0V and 5V as rails with Vcom = 2.5V
  https://jansson.us/resistors.html
- Use BIPOLAR TVS Diodes for D6 and D7
- Use BIPOLAR TVS Diodes for D6 and D8
- Pin compatible alternatives
  - THS4521
  - THS4541
  - THS4551
  - THS4561
- Title
- Revision:
- Design Engineer:
- Date:
- Project:
- Sheet
- of

### Library data of the parts
C23 C75 = Cap_0603: MPN: 885012006057; MF: Würth Elektronik; Voltage: 50V; Dielectric: NP0; Value: 100pF; Supplier 1: Mouser; Supplier 2: *; Supplier Part Number 1: 710-885012006057; Supplier Part Number 2: *; Package: 0603
C34 C38 = Cap_0603: MPN: C0603C560J5GACTU; MF: Kemet; Voltage: 50V; Dielectric: C0G; Value: 56pF; Supplier 1: Mouser; Supplier 2: *; Supplier Part Number 1: 80-C0603C560J5G; Supplier Part Number 2: *; Package: 0603
C36 C39 C40 C42 C44 = Cap_0603: as C82 on sheet CarrierConnector; Value: 100nF; Supplier 1: Mouser; Supplier 2: Mouser; Supplier Part Number 1: 603-CC603KRX7R9BB104; Supplier Part Number 2: 710-885382206004; Package: 0603
D6 D7 = GBLCxx: ESD Suppressor Diode TVS Bi-Dir 5V; MPN: AQ4021-01FTG-C; MF: Littelfuse; Reverse Standoff Voltage: 5.0V; Breakdown Voltage: 6.3V; Package: SOD-323; Supplier 1: Mouser; Supplier 2: Digi-Key; Supplier Part Number 1: 576-AQ4021-01FTG-C; Supplier Part Number 2: F10397CT-ND; ComponentLink1Description: Datasheet; Supplier 3: Farnell; Supplier Part Number 3: 2834965; Model: AQ4021
  D6: ComponentLink1URL: https://static6.arrow.com/aropdfconversion/cf1b73a38d87e210bfa153441e03466b149f09ba/gblci.pdf
  D7: ComponentLink1URL: https://www.littelfuse.com/~/media/electronics/datasheets/tvs_diode_arrays/littelfuse_tvs_diode_array_aq4021_datasheet.pdf.pdf?src-supplier=Digi-Key
R15 R16 = R_0603: as R3 on sheet CarrierConnector; Value: 0R; Supplier 1: Mouser; Supplier Part Number 1: 71-CRCW06030000Z0EBC; Package: 0603
R17 R20 R23 R29 = R_0603: Precision Resistor 1k 0.1% 0603; MPN: PCF-W0603LF-03-1001-B-P-LT; MF: IRC/TT Electronics; Precision: 0,1%; Value: 1k, 0.1%; Supplier 1: Mouser; Supplier Part Number 1: 66-PCFW0603LF031001B; Package: 0603; Supplier 2: RSComponents; Supplier Part Number 2: 178-6613; Supplier 3: RSComponents; Supplier Part Number 3: 520-3620
R22 = R_1206: WID SMD 1M 5% 0,25W; MPN: APC1206B200RN; AN: 22757; Mixed: SMT; Preferred: Yes; MF: AECOL/Ohmite; Case: 1206; Value: 200R; Technology: TK100; Created: 2018_07_20_AGeiger; Tolerance: 5%; Supplier 1: Mouser; Supplier Part Number 1: 284-APC1206B200RN
R26 R27 R65 R66 = R_0603: as R1 on sheet CarrierConnector; Value: 100R; Supplier 1: Mouser; Supplier Part Number 1: 603-AC0603FR-13100RL; Package: 0603
TP26 TP27 = TP_1mm: Testpoint 1mm; Created: 2018_06_25_AGeiger
  TP26: Value: +
  TP27: Value: -
U7 = LT6203_MSOP8: 2 Ch Low Noise, Low Power OpAmp; MPN: LT6203CMS8#PBF; MF: Linear Technology; Created: Kreppel_20190830; Package: MSOP-8; Supplier 1: Mouser; Supplier Part Number 1: 584-LT6203CMS8#PBF; ComponentLink1Description: Manufacturer; ComponentLink1URL: https://www.analog.com/en/index.html; ComponentLink2Description: Datasheet; ComponentLink2URL: https://www.analog.com/media/en/technical-documentation/data-sheets/620234fd.pdf
U15 = THS4521IDGKR: IC AMP RRO NEG OUT VLP 8VSSOP (Single Channel fully differential Amplifier); MPN: THS4561IDGKR; MF: Texas Instruments; Max Supply Voltage: 5.5V; Supplier 1: Mouser; Category: Amplifiers - Op Amps, Buffer, Instrumentation; Stock 1: 12114; Pricing 1: 1=2,55000, 10=2,29000, 25=2,16000, 100=1,78000, 250=1,59000, 500=1,54000, 1000=1,28000, 2500=1,25000, 1=2,83000, 10=2,54000, 25=2,40000, 100=1,98000, 250=1,77000, 500=1,71000 (EUR); ComponentLink1URL: https://datasheet.ciiva.com/14456/sbos458f-14456592.pdf?src-supplier=Avnet; ComponentLink1Description: old Datasheet; ComponentLink2URL: https://datasheet.ciiva.com/18622/ths4521-18622155.pdf?src-supplier=Digi-Key; ComponentLink2Description: Datasheet; ComponentLink3URL: https://www.ti.com/; ComponentLink3Description: Manufacturer; Supplier Part Number 1: 595-THS4561IDGKR; Supplier 2: Mouser; Supplier Part Number 2: 595-THS4521IDGKR

## Sheet Power_Neg.SchDoc
size A4; Author: Simon Lukas; CompanyName: Technische Hochschule Nürnberg Georg Simon Ohm; Organization: UltraZohm; Address1: Kesslerplatz 12; Address2: 90489 Nürnberg; Address3: GERMANY; Website: www.ultrazohm.com
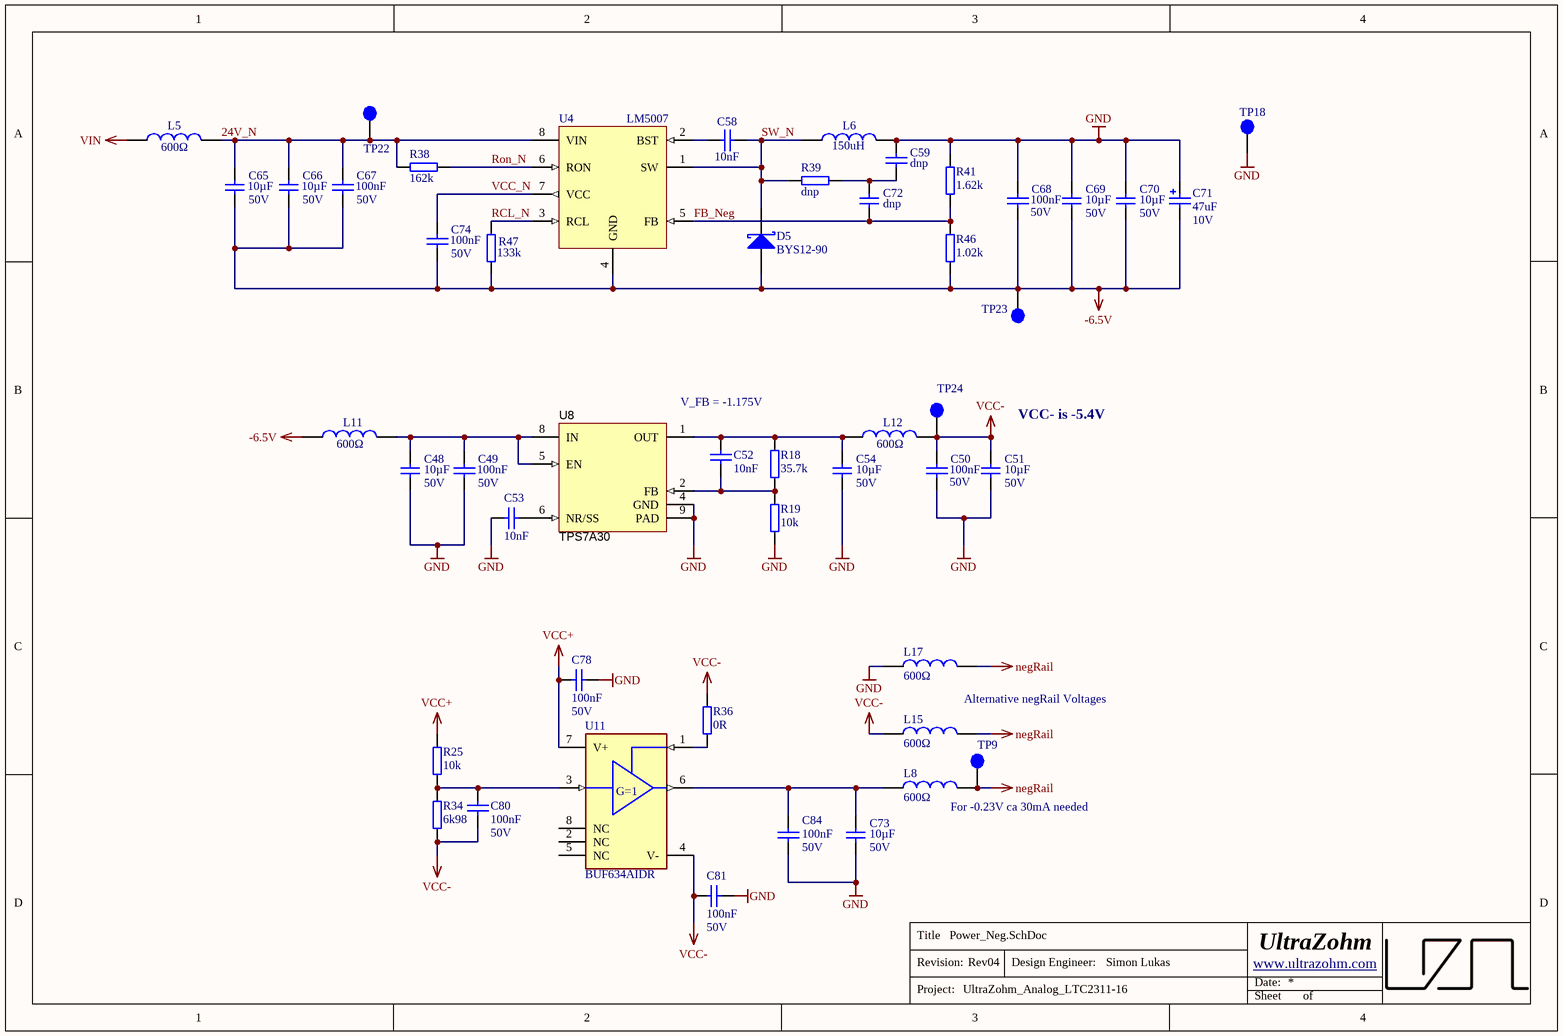
[diagram p5: Power_Neg.SchDoc]

### Parts
C48  10µF  Voltage: 50V  [C_1206]
C49  100nF  Voltage: 50V  [CAPC1608X07N]
C50  100nF  Voltage: 50V  [CAPC1608X07N]
C51  10µF  Voltage: 50V  [C_1206]
C52  10nF  [CAPC1608X07N]
C53  10nF  [CAPC1608X07N]
C54  10µF  Voltage: 50V  [C_1206]
C58  10nF  [CAPC1608X07N]
C59  dnp  [CAPC1608X07N]
C65  10µF  Voltage: 50V  [C_1206]
C66  10µF  Voltage: 50V  [C_1206]
C67  100nF  Voltage: 50V  [CAPC1608X07N]
C68  100nF  Voltage: 50V  [CAPC1608X07N]
C69  10µF  Voltage: 50V  [C_1206]
C70  10µF  Voltage: 50V  [C_1206]
C71  47uF  Voltage: 10V  [WCAP-ASLI_5x5.5]
C72  dnp  [C_1206]
C73  10µF  Voltage: 50V  [C_1206]
C74  100nF  Voltage: 50V  [CAPC1608X07N]
C78  100nF  Voltage: 50V  [CAPC1608X07N]
C80  100nF  Voltage: 50V  [CAPC1608X07N]
C81  100nF  Voltage: 50V  [CAPC1608X07N]
C84  100nF  Voltage: 50V  [CAPC1608X07N]
D5  BYS12-90  [DIOM4227X23N]
L5  600Ω  [WE-CBF_0805_High Current]
L6  150uH  [SMT_inductor_1050_Performance]
L8  600Ω  [WE-CBF_0805_High Current]
L11  600Ω  [WE-CBF_0805_High Current]
L12  600Ω  [WE-CBF_0805_High Current]
L15  600Ω  [WE-CBF_0805_High Current]
L17  600Ω  [WE-CBF_0805_High Current]
R18  35.7k  [RESC1608X06N]
R19  10k  [RESC1608X06N]
R25  10k  [RESC1608X06N]
R34  6k98  [RESC1608X06N]
R36  0R  [RESC1608X06N]
R38  162k  [RESC1608X06N]
R39  dnp  [RESC1608X06N]
R41  1.62k  [RESC1608X06N]
R46  1.02k  [RESC1608X06N]
R47  133k  [RESC1608X06N]
TP9  negRail  [TP_1mm]  (value not drawn)  (no BOM)
TP18  GND  [TP_1mm]  (value not drawn)  (no BOM)
TP22  VIN  [TP_1mm]  (value not drawn)  (no BOM)
TP23  -6.5V  [TP_1mm]  (value not drawn)  (no BOM)
TP24  VCC-  [TP_1mm]  (value not drawn)  (no BOM)
U4  LM5007  [TSOP65P490X110-8N]
U8  TPS7A30  [DGN0008D_N]
U11  BUF634AIDR  [FP-BUF634AIDR-MFG]

### Nets
-6.5V: C65.1 C66.1 C67.2 C68.1 C69.1 C70.1 C71.1(N) C74.2 D5.2(A) L11.1 R46.2 R47.1 TP23.1 U4.4(GND)
GND: C48.1 C49.2 C50.1 C51.1 C53.2 C54.1 C59.1 C68.2 C69.2 C70.2 C71.2(P) C73.1 C78.1 C81.1 C84.1 L6.2 L17.1 R19.2 R41.1 TP18.1 U8.4(GND) U8.9(PAD)
negRail: L8.2 L15.2 L17.2 TP9.1
VCC+: C78.2 R25.2 U11.7(V+)
VCC-: C50.2 C51.2 C80.2 C81.2 L12.2 L15.1 R34.1 R36.2 TP24.1 U11.4(V-)
VIN: L5.1
24V_N: C65.2 C66.2 C67.1 L5.2 R38.2 TP22.1 U4.8(VIN)
FB_Neg: C72.2 R41.2 R46.1 U4.5(FB)
RCL_N: R47.2 U4.3(RCL)
Ron_N: R38.1 U4.6(RON)
SW_N: C58.1 D5.1(K) L6.1 R39.2 U4.1(SW)
VCC_N: C74.1 U4.7(VCC)
NetC48_2: C48.2 C49.1 L11.2 U8.5(EN) U8.8(IN)
NetC52_1: C52.1 C54.2 L12.1 R18.1 U8.1(OUT)
NetC52_2: C52.2 R18.2 R19.1 U8.2(FB)
NetC53_1: C53.1 U8.6(NR/SS)
NetC58_2: C58.2 U4.2(BST)
NetC59_2: C59.2 C72.1 R39.1
NetC73_2: C73.2 C84.2 L8.1 U11.6(VO)
NetC80_1: C80.1 R25.1 R34.2 U11.3(VIN)
NetR36_1: R36.1 U11.1(BW)

Not connected (* = marked no-connect by the designer): U8 3(NC) 7(DNC); U11 2(NC) 5(NC) 8(NC)

### Notes on the sheet
- V_FB = -1.175V
- (near C51) VCC- is -5.4V
- Alternative negRail Voltages
- (near L8) For -0.23V ca 30mA needed
- Title
- Revision:
- Design Engineer:
- Date:
- Project:
- Sheet
- of
- (in symbol BUF634A) G=1

### Library data of the parts
C48 C51 C54 C69 C70 C73 = C_1206: as C35 on sheet AnalogConnector; Package: 1206; Value: 10µF; Created: 2020_09_17_Liegmann; Supplier 1: Mouser; Supplier Part Number 1: 187-CL31A106MBHNNNE
C49 C50 C67 C68 C74 = Cap_0603: as C41 on sheet AnalogConnector; Value: 100nF; Supplier 1: Mouser; Supplier 2: Mouser; Supplier Part Number 1: 603-CC603KRX7R9BB104; Supplier Part Number 2: 710-885382206004; Package: 0603
C52 C53 C58 = Cap_0603: MPN: 885012206065; MF: Würth Elektronik; Voltage: 25V; Dielectric: X7R; Value: 10nF; Supplier 1: Mouser; Supplier 2: Digi-Key; Supplier Part Number 1: 710-885012206065; Supplier Part Number 2: 732-7983-1-ND; Package: 0603
C59 = Cap_0603: MPN: C0603C752J3GACTU; possibleValue: 7.5nF; MF: KEMET; Voltage: 25V; Dielectric: C0G; Tolerance: 5%; Supplier 1: Mouser; Supplier 2: *; Supplier Part Number 1: 80-C0603C752J3GACTU; Supplier Part Number 2: *; Package: 0603; Value: dnp
C65 C66 = C_1206: as C43 on sheet AnalogConnector; Package: 1206; Value: 10µF; Supplier 1: Mouser; Supplier Part Number 1: 187-CL31A106MBHNNNE
C71 = 865080142007: as C20 on sheet AnalogConnector; ComponentLink1Description: Manufacturer; ComponentLink1URL: http://www.we-online.de; ComponentLink2Description: Datasheet; ComponentLink2URL: https://www.we-online.com/catalog/datasheet/865080142007.pdf; Height: 5.5mm; Mounting Technology: SMT; Operating Temperature: -55 to +105degC; Packaging: Tape and Reel; Published Date: May 2020; Diameter: 5mm; Supplier 1: Mouser; Supplier Part Number 1: 710-865080242004; Value: 47uF
C72 = C_1206: Capacitor 1206; MPN: GRM3195C1H273JA01D; possibleValue: 0.027µF; Tolerance: 5%; MF: Murata Electronics; Dielectric: C0G; Voltage: 50V; Package: 1206; Supplier 1: Mouser; Supplier Part Number 1: 81-GRM315C1H273JA01D; Value: dnp
C78 C80 C81 C84 = Cap_0603: as C82 on sheet CarrierConnector; Value: 100nF; Supplier 1: Mouser; Supplier 2: Mouser; Supplier Part Number 1: 603-CC603KRX7R9BB104; Supplier Part Number 2: 710-885382206004; Package: 0603
D5 = BYS12-90: Schottky Diode; MPN: BYS12-90-E3/TR3; MF: Vishay; Forward Voltage: 750mV; Reverse Voltage: 90V; Rated Current: 1.5A; Package: DO-214AC; Supplier 1: Farnell; Supplier 2: Mouser; Supplier 3: Digi-Key; Supplier Part Number 1: 2889144; Supplier Part Number 2: 625-BYS12-90-E3/TR3; Supplier Part Number 3: BYS12-90-E3/GICT-ND; ComponentLink1Description: Manufacturer; ComponentLink1URL: https://www.vishay.com/; ComponentLink2Description: Datasheet; ComponentLink2URL: https://www.vishay.com/docs/88950/bys12-90.pdf
L5 L11 L12 = WE-CBF, 742792040: WE-CBF SMD EMI Suppression Ferrite Bead, 0805, 600Ω; MF: Würth Elektronik; Type: High Current; ComponentLink1Description: Manufacturer; ComponentLink1URL: http://www.we-online.de; ComponentLink2Description: Datasheet; ComponentLink2URL: http://katalog.we-online.de/pbs/datasheet/742792040.pdf; MPN: 742792040; Value: 600Ω; Size: 0805; Supplier 1: Farnell; Supplier 2: Mouser; Supplier 3: Digi-Key; Supplier Part Number 1: 1635735; Supplier Part Number 2: 710-742792040; Supplier Part Number 3: 732-1620-1-ND
L6 = B82464G4154M: SMT power Inductor, 150uH, 320m DRC; MF: EPCOS / TDK; Rated Current: 0.85 A; MPN: B82464G4154M; Supplier 1: Mouser; Supplier Part Number 1: 871-B82464G4154M; Value: 150uH; DCR: 320m; ComponentLink1Description: Manufacturer; ComponentLink1URL: https://www.tdk-electronics.tdk.com/de; ComponentLink2Description: Datasheet; ComponentLink2URL: https://www.tdk-electronics.tdk.com/inf/30/db/ind_2008/b82464g4.pdf
L8 L15 L17 = WE-CBF, 742792040: WE-CBF SMD EMI Suppression Ferrite Bead, 0805, 600Ω; MF: Wurth Elektronik; Type: High Current; PublishedDate: Aug 2016; ComponentLink1Description: Manufacturer; ComponentLink1URL: http://www.we-online.de; ComponentLink2Description: Datasheet; ComponentLink2URL: http://katalog.we-online.de/pbs/datasheet/742792040.pdf; MPN: 742792040; Value: 600Ω; Size: 0805; Supplier 1: Farnell; Supplier 2: Mouser; Supplier 3: Digi-Key; Supplier Part Number 1: 2761567; Supplier Part Number 2: 710-742792040; Supplier Part Number 3: 732-1620-1-ND
R18 = R_0603: MPN: CR0603-FX-3572ELF; MF: Bourns; Tolerance: 1%; Value: 35.7k; Supplier 1: Mouser; Supplier Part Number 1: 652-CR0603FX-3572ELF; Package: 0603
R19 R25 = R_0603: MPN: CR0603-FX-1002ELF; MF: Bourns; Tolerance: 1%; Value: 10k; Supplier 1: Mouser; Supplier Part Number 1: 652-CR0603FX-1002ELF; Package: 0603
R34 = R_0603: MPN: CR0603-FX-6981ELF; MF: Bourns; Tolerance: 1%; Value: 6k98; Supplier 1: Mouser; Supplier Part Number 1: 652-CR0603FX-6981ELF; Package: 0603
R36 = R_0603: as R3 on sheet CarrierConnector; Value: 0R; Supplier 1: Mouser; Supplier Part Number 1: 71-CRCW06030000Z0EBC; Package: 0603
R38 = R_0603: MPN: CR0603-FX-1623ELF; MF: Bourns; Value: 162k; Supplier 1: Mouser; Supplier Part Number 1: 652-CR0603-FX1623ELF; Package: 0603
R39 = R_0603: MPN: AC0603FR-1375KL; possibleValue: 75k; MF: Yageo; Supplier 1: Mouser; Supplier Part Number 1: 603-AC0603FR-1375KL; Package: 0603; Value: dnp
R41 = R_0603: MPN: CR0603-FX-1621ELF; MF: Bourns; Tolerance: 1%; Value: 1.62k; Supplier 1: Mouser; Supplier Part Number 1: 652-CR0603FX-1621ELF; Package: 0603
R46 = R_0603: MPN: CR0603-FX-1021ELF; MF: Bourns; Tolerance: 1%; Value: 1.02k; Supplier 1: Mouser; Supplier Part Number 1: 652-CR0603FX-1021ELF; Package: 0603
R47 = R_0603: MPN: CR0603-FX-1333ELF; MF: Bourns; Value: 133k; Supplier 1: Mouser; Supplier Part Number 1: 652-CR0603FX-1333ELF; Package: 0603
TP9 TP18 TP22-TP24 = TP_1mm: Testpoint 1mm; Created: 2018_06_25_AGeiger; Value: Testpoint 1mm
U4 = LM5007: Buck Converter, 9-75Vin, 2.5-73Vout; MPN: LM5007MM/NOPB; MF: Texas Instruments; Supplier 1: Farnell; Supplier 2: Mouser; Supplier 3: Digi-Key; Supplier Part Number 1: 9779345; Supplier Part Number 2: 926-LM5007MM/NOPB; Supplier Part Number 3: LM5007MM/NOPBCT-ND; Package: VSSOP-8; ComponentLink1Description: Manufacturer; ComponentLink1URL: https://www.ti.com/; ComponentLink2Description: Datasheet; ComponentLink2URL: https://www.ti.com/lit/ds/symlink/lm5007.pdf?ts=1616234834930&ref_url=https%253A%252F%252Fwww.google.ru%252F
U8 = TPS7A3001DGN: -36V, -200mA, Ultralow-Noise, High PSRR, Adjustable -1.18 to -33 V Output, Negative Linear Regulator, 8-pin MSOP (DGN), -40 to 125 degC, Green (RoHS & no Sb/Br); MF: Texas Instruments; Parameter 1: Farnell; PackageReference: DGN0008D; PackageDescription: 8-pin Plastic Small Outline, Body 3 x 3 mm, Pitch 0.65 mm; Supplier 1: Digi-Key; Supplier Part Number 1: 296-27750-1-ND; MPN: TPS7A3001DGN; ComponentLink1Description: Manufacturer URL; ComponentLink1URL: http://www.ti.com/; ComponentLink2Description: Datasheet; ComponentLink2URL: http://www.ti.com/general/docs/lit/getliterature.tsp?genericPartNumber=TPS7A3001&fileType=pdf; ComponentLink3Description: Package Specification; ComponentLink3URL: http://www.ti.com/litv/pdf/mpds046e; Supplier 2: Mouser; Supplier Part Number 2: 595-TPS7A3001DGNT; Supplier Part Number 3: 3122632
U11 = BUF634A: IC OP AMP BUFFER 8SOIC; Voltage Gain: 0.00099V/mV; Standoff Height: 0.11mm; Min Dual Supply Voltage: 2.25V; Gain Bandwidth: 240MHz; Output Current Per Channel: 250mA; Input Offset Voltage: 36mV; Min Supply Voltage: 4.5V; Number Of Channels: 1; Max Junction Temp: +150°C; Max Supply Voltage: 36V; Bandwidth: 35-210MHz; Input Bias Current: 0.03-0.25uA; Max Dual Supply Voltage: 18V; MF: Texas Instruments; Nominal Supply Current: 1.5-8.5mA; Height: 1.75mm; MPN: BUF634AIDR; Automotive: No; Digikey Description: IC OP AMP BUFFER 8SOIC; Device Class L3: Buffer; ComponentLink2URL: http://www.ti.com/lit/ds/symlink/buf634a.pdf; Category: IC; Device Class L2: Linear ICs; Device Class L1: Integrated Circuits (ICs); Temperature Range Low: -40°C; Package: SOIC8; Temperature: -40°C to +125°C; Temperature Range High: +125°C; Mouser Description: High-Speed Buffer 1 Channel 35MHz to 210MHz 36V 250mA Bipolar 8-Pin SOIC T/R; Octopart: https://octopart.com/buf634aidr-texas+instruments-99505311; RoHS: TRUE; Lead Free: Yes; ComponentLink2Description: Datasheet; Supplier 1: Mouser; Supplier Part Number 1: 595-BUF634AIDR